# Altium schematic sheet 07 Secure Element.SchDoc: Secure Element
size 420 x 297 mm; SheetNumber: 7; SheetTotal: 10
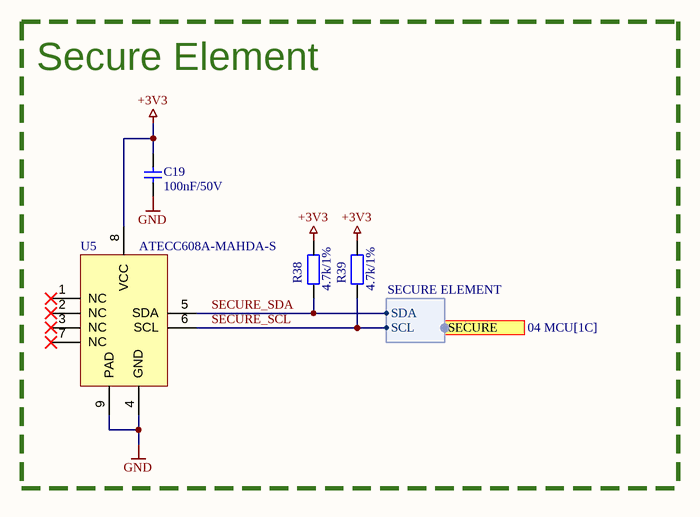
[diagram p0: 07 Secure Element.SchDoc]

## Parts
C19  100nF/50V  [CAPC1005X06M-0402]
R38  4.7k/1%  [RESC1005X04M-0402]
R39  4.7k/1%  [RESC1005X04M-0402]
U5  ATECC608A-MAHDA-S  [SON50P200X60_HS-9N]

## Blocks framed on the sheet
Secure Element: C19 R38 R39 U5

## Ports
SECURE (harness SECURE ELEMENT, see 04 MCU[1C])

## Harnesses
SECURE ELEMENT: SDA, SCL

## Nets
+3V3: C19.2 R38.2 R39.2 U5.8(VCC)
GND: C19.1 U5.4(GND) U5.9(PAD)
SECURE_SCL: R39.1 U5.6(SCL) ; port SECURE.SCL
SECURE_SDA: R38.1 U5.5(SDA) ; port SECURE.SDA

Not connected (* = marked no-connect by the designer): U5 1(NC)* 2(NC)* 3(NC)* 7(NC)*

## Notes on the sheet
- Title
- Project
- Size
- Date
- Revision
- A3
- Designed By

## Library data of the parts
C19 = GRM155R71H104KE14D: 0.1 µF ±10% 50V Ceramic Capacitor X7R 0402 (1005 Metric); ComponentLink1Description: Datasheet; ComponentLink1URL: https://search.murata.co.jp/Ceramy/image/img/A01X/G101/ENG/GRM155R60J475ME47-01.pdf; MPN: GRM155R71H104KE14D
R38 R39 = RC0402FR-074K7L: 4.7 kOhms ±1% 0.063W, 1/16W Chip Resistor 0402 (1005 Metric) Moisture Resistant Thick Film; ComponentLink1Description: Datasheet; ComponentLink1URL: https://www.yageo.com/upload/media/product/productsearch/datasheet/rchip/PYu-RC_Group_51_RoHS_L_12.pdf; MPN: RC0402FR-074K7L
U5 = ATECC608A-MAHDA-S: Authentication Chip 8-UDFN (2x3); MPN: ATECC608A-MAHDA-S; ComponentLink1Description: Datasheet; ComponentLink1URL: https://ww1.microchip.com/downloads/en/DeviceDoc/ATECC608A-CryptoAuthentication-Device-Summary-Data-Sheet-DS40001977B.pdf